# EAGLE schematic avr_lag2 (EAGLE 5.07)
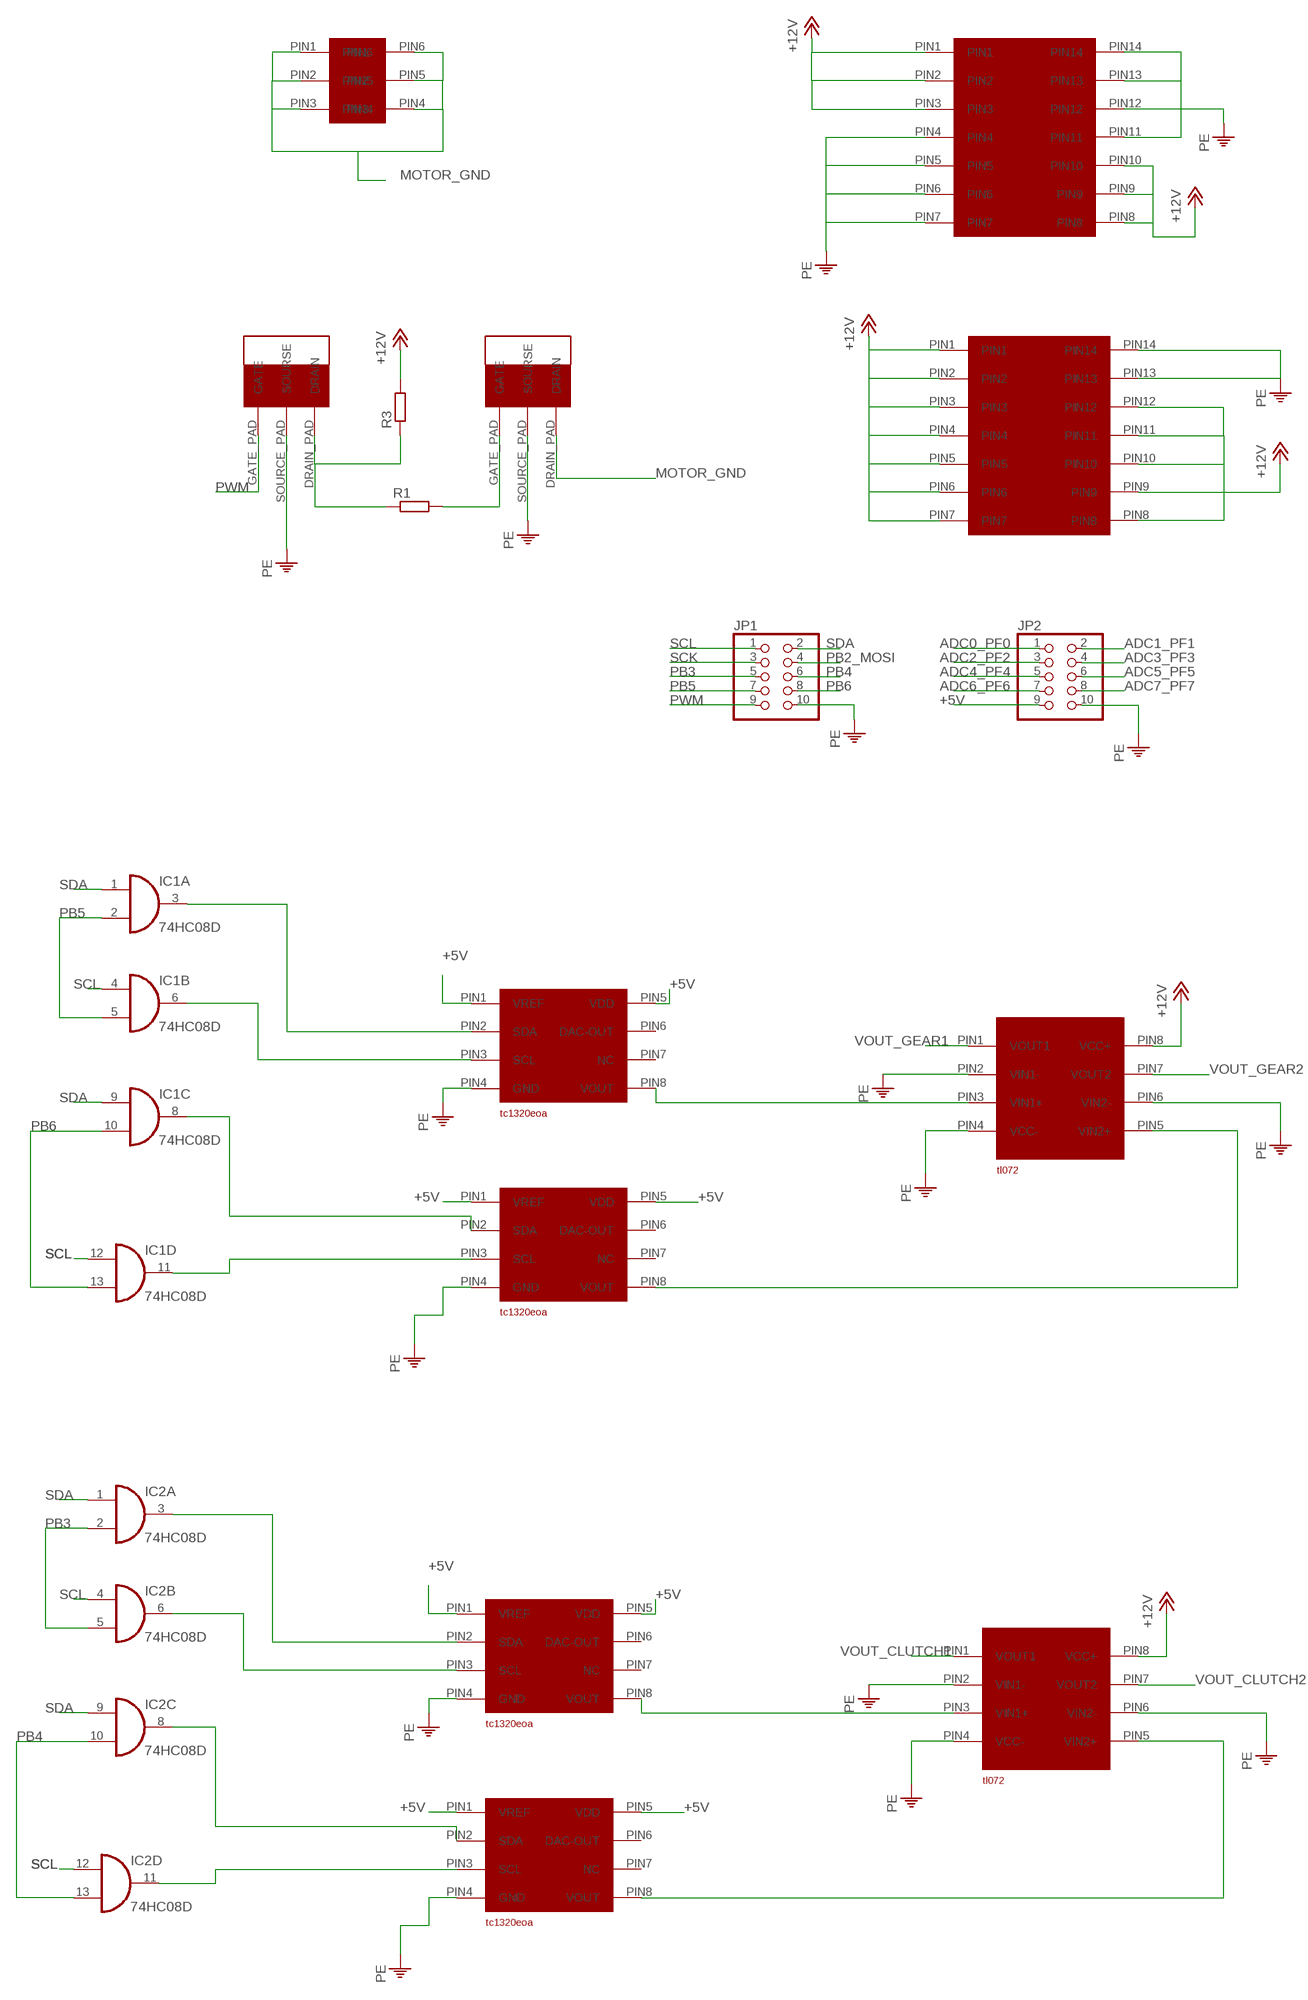
[diagram p0: schematic, sheet 1]

## Parts
IC1  74HC08D  [SO14]
IC2  74HC08D  [SO14]
JP1  PINHD-2X5  [2X05]
JP2  PINHD-2X5  [2X05]
R1  R-EU_0207/10  [0207/10]
R3  R-EU_0207/10  [0207/10]
U$1  IRFZ46N  [IRFZ46N]
U$2  IRFZ46N  [IRFZ46N]
U$3  MICROFIT14  [MICROFIT14SOCK]
U$4  MICROFIT14  [MICROFIT14SOCK]
U$5  MICROFIT6  [MICROFIT6SOCK]
U$6  TC1320EOA  [SOIC8]
U$7  TC1320EOA  [SOIC8]
U$8  TC1320EOA  [SOIC8]
U$9  TL072  [SOIC8]
U$10  TC1320EOA  [SOIC8]
U$11  TL072  [SOIC8]

## Nets
+5V: JP2.9 U$6.PIN1(VREF) U$6.PIN5(VDD) U$7.PIN1(VREF) U$7.PIN5(VDD) U$8.PIN1(VREF) U$8.PIN5(VDD) U$10.PIN1(VREF) U$10.PIN5(VDD)
+12V: R3.2 U$3.PIN1 U$3.PIN2 U$3.PIN3 U$3.PIN8 U$3.PIN9 U$3.PIN10 U$4.PIN1 U$4.PIN2 U$4.PIN3 U$4.PIN4 U$4.PIN5 U$4.PIN6 U$4.PIN7 U$4.PIN8 U$4.PIN9 U$4.PIN10 U$4.PIN11 U$4.PIN12 U$9.PIN8(VCC+) U$11.PIN8(VCC+)
ADC0_PF0: JP2.1
ADC1_PF1: JP2.2
ADC2_PF2: JP2.3
ADC3_PF3: JP2.4
ADC4_PF4: JP2.5
ADC5_PF5: JP2.6
ADC6_PF6: JP2.7
ADC7_PF7: JP2.8
MOTOR_GND: U$2.DRAIN_PAD(DRAIN) U$5.PIN1 U$5.PIN2 U$5.PIN3 U$5.PIN4 U$5.PIN5 U$5.PIN6
N$1: R1.1 R3.1 U$1.DRAIN_PAD(DRAIN)
N$2: R1.2 U$2.GATE_PAD(GATE)
N$5: U$7.PIN8(VOUT) U$9.PIN3(VIN1+)
N$6: U$8.PIN8(VOUT) U$9.PIN5(VIN2+)
N$9: IC1.11(D:O) U$8.PIN3(SCL)
N$12: IC1.8(C:O) U$8.PIN2(SDA)
N$13: IC1.6(B:O) U$7.PIN3(SCL)
N$14: IC1.3(A:O) U$7.PIN2(SDA)
N$15: U$6.PIN8(VOUT) U$11.PIN3(VIN1+)
N$16: U$10.PIN8(VOUT) U$11.PIN5(VIN2+)
N$17: IC2.11(D:O) U$10.PIN3(SCL)
N$18: IC2.8(C:O) U$10.PIN2(SDA)
N$19: IC2.6(B:O) U$6.PIN3(SCL)
N$20: IC2.3(A:O) U$6.PIN2(SDA)
PB2_MOSI: JP1.4
PB3: IC2.2(A:I1) IC2.5(B:I1) JP1.5
PB4: IC2.10(C:I1) IC2.13(D:I1) JP1.6
PB5: IC1.2(A:I1) IC1.5(B:I1) JP1.7
PB6: IC1.10(C:I1) IC1.13(D:I1) JP1.8
PE: JP1.10 JP2.10 U$1.SOURCE_PAD(SOURSE) U$2.SOURCE_PAD(SOURSE) U$3.PIN4 U$3.PIN5 U$3.PIN6 U$3.PIN7 U$3.PIN11 U$3.PIN12 U$3.PIN13 U$3.PIN14 U$4.PIN13 U$4.PIN14 U$6.PIN4(GND) U$7.PIN4(GND) U$8.PIN4(GND) U$9.PIN2(VIN1-) U$9.PIN4(VCC-) U$9.PIN6(VIN2-) U$10.PIN4(GND) U$11.PIN2(VIN1-) U$11.PIN4(VCC-) U$11.PIN6(VIN2-)
PWM: JP1.9 U$1.GATE_PAD(GATE)
SCK: JP1.3
SCL: IC1.4(B:I0) IC1.12(D:I0) IC2.4(B:I0) IC2.12(D:I0) JP1.1
SDA: IC1.1(A:I0) IC1.9(C:I0) IC2.1(A:I0) IC2.9(C:I0) JP1.2
VOUT_CLUTCH1: U$11.PIN1(VOUT1)
VOUT_CLUTCH2: U$11.PIN7(VOUT2)
VOUT_GEAR1: U$9.PIN1(VOUT1)
VOUT_GEAR2: U$9.PIN7(VOUT2)
Unconnected: U$6.PIN6(DAC-OUT) U$6.PIN7(NC) U$7.PIN6(DAC-OUT) U$7.PIN7(NC) U$8.PIN6(DAC-OUT) U$8.PIN7(NC) U$10.PIN6(DAC-OUT) U$10.PIN7(NC)

## Power pins joined to a net without a drawn wire
GND: IC1.7(P:GND) IC2.7(P:GND)
VCC: IC1.14(P:VCC) IC2.14(P:VCC)

## Library data of the parts
IC1 IC2 = 74xx-eu:74*08: Quad 2-input AND gate
JP1 JP2 = pinhead:PINHD-2X5: PIN HEADER
R1 R3 = resistor:R-EU_: RESISTOR, European symbol
U$1 U$2 = unicorn:IRFZ46N
U$3 U$4 = unicorn:MICROFIT14
U$5 = unicorn:MICROFIT6
U$6-U$8 U$10 = unicorn:TC1320EOA
U$9 U$11 = unicorn:TL072